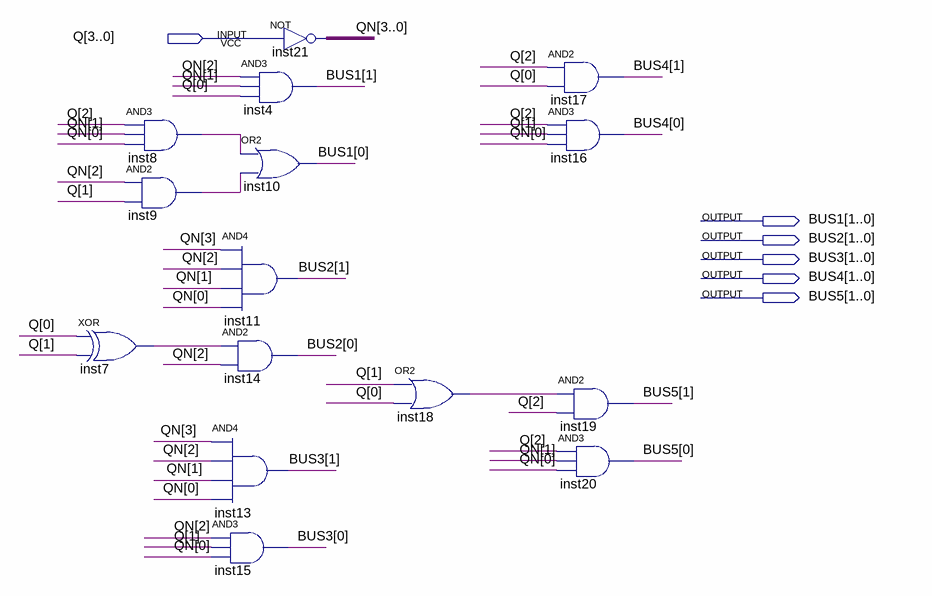
[diagram p0: schematic sheet]
// Quartus schematic BUS.bdf as structural Verilog: 15 symbols, 6 pins
module BUS (
  input  [3:0] Q,
  output [1:0] BUS1,
  output [1:0] BUS2,
  output [1:0] BUS3,
  output [1:0] BUS4,
  output [1:0] BUS5
);

  wire inst7_out, inst8_out, inst9_out, inst18_out;
  wire [3:0] QN;

  xor inst7 (inst7_out, Q[0], Q[1]);
  and inst8 (inst8_out, Q[2], QN[1], QN[0]);
  and inst9 (inst9_out, QN[2], Q[1]);
  and inst4 (BUS1[1], QN[2], QN[1], Q[0]);
  or inst10 (BUS1[0], inst8_out, inst9_out);
  and inst11 (BUS2[1], QN[3], QN[2], QN[1], QN[0]);
  and inst14 (BUS2[0], inst7_out, QN[2]);
  and inst13 (BUS3[1], QN[3], QN[2], QN[1], QN[0]);
  and inst15 (BUS3[0], QN[2], Q[1], QN[0]);
  assign QN = ~Q;  // NOT inst21, 4 bits wide
  or inst18 (inst18_out, Q[1], Q[0]);
  and inst17 (BUS4[1], Q[2], Q[0]);
  and inst16 (BUS4[0], Q[2], Q[1], QN[0]);
  and inst19 (BUS5[1], inst18_out, Q[2]);
  and inst20 (BUS5[0], Q[2], QN[1], QN[0]);
endmodule
